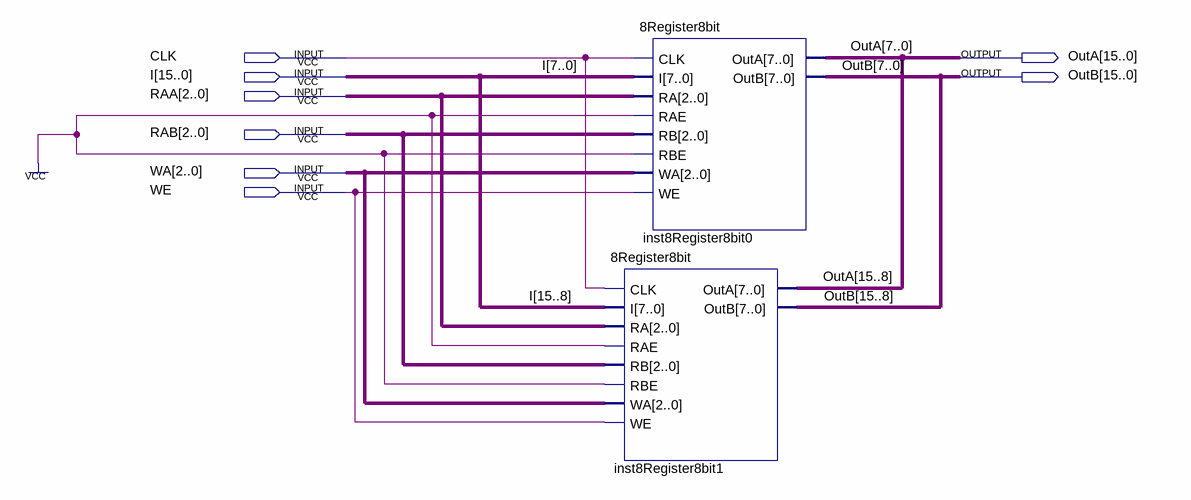
[diagram p0: schematic sheet]
// Quartus schematic 8Register16bit.bdf as structural Verilog: 2 symbols, 8 pins
module \8Register16bit  (
  input  CLK,
  input  [15:0] I,
  input  [2:0] RAA,
  input  [2:0] RAB,
  input  [2:0] WA,
  input  WE,
  output [15:0] OutA,
  output [15:0] OutB
);

  \8Register8bit  inst8Register8bit0 (
    .CLK(CLK), .I(I[7:0]), .RA(RAA), .RAE(1'b1), .RB(RAB), .RBE(1'b1), .WA(WA), .WE(WE), .OutA(OutA[7:0]),
    .OutB(OutB[7:0]));
  \8Register8bit  inst8Register8bit1 (
    .CLK(CLK), .I(I[15:8]), .RA(RAA), .RAE(1'b1), .RB(RAB), .RBE(1'b1), .WA(WA), .WE(WE), .OutA(OutA[15:8]),
    .OutB(OutB[15:8]));
endmodule
